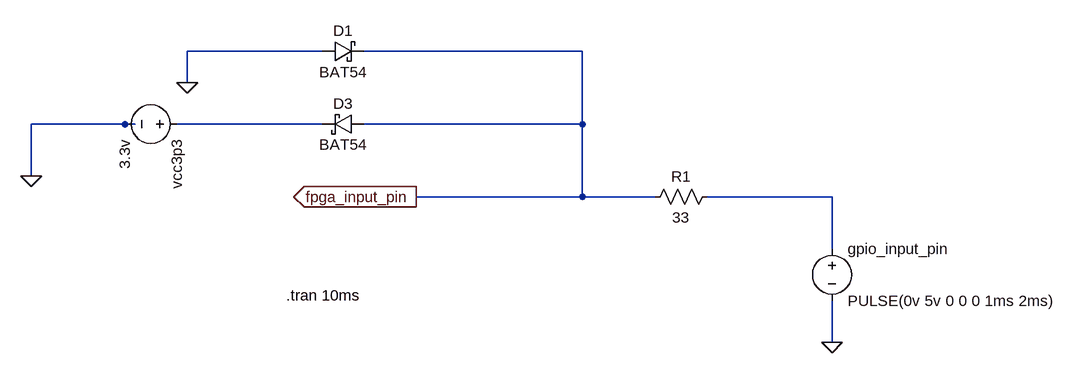
[diagram p0: schematic de0-cv-gpio-test2.asc]
de0-cv-gpio-test2.asc, the LTspice schematic file:
Version 4
SHEET 1 984 680
WIRE -192 -48 -400 -48
WIRE 208 -48 -128 -48
WIRE -400 0 -400 -48
WIRE -496 64 -640 64
WIRE -480 64 -496 64
WIRE -192 64 -416 64
WIRE 208 64 208 -48
WIRE 208 64 -128 64
WIRE -640 144 -640 64
WIRE 208 176 208 64
WIRE 208 176 -48 176
WIRE 320 176 208 176
WIRE 592 176 400 176
WIRE 592 256 592 176
WIRE 592 400 592 336
FLAG -400 0 0
FLAG -48 176 fpga_input_pin
IOPIN -48 176 Out
FLAG 592 400 0
FLAG -640 144 0
SYMBOL voltage 592 240 R0
WINDOW 123 0 0 Left 2
WINDOW 39 0 0 Left 2
SYMATTR InstName gpio_input_pin
SYMATTR Value PULSE(0v 5v 0 0 0 1ms 2ms)
SYMBOL voltage -400 64 R90
WINDOW 123 0 0 Left 2
WINDOW 39 0 0 Left 2
SYMATTR InstName vcc3p3
SYMATTR Value 3.3v
SYMBOL res 416 160 R90
WINDOW 0 0 56 VBottom 2
WINDOW 3 32 56 VTop 2
SYMATTR InstName R1
SYMATTR Value 33
SYMBOL schottky -128 48 R90
WINDOW 0 0 32 VBottom 2
WINDOW 3 32 32 VTop 2
SYMATTR InstName D3
SYMATTR Value BAT54
SYMATTR Description Diode
SYMATTR Type diode
SYMBOL schottky -192 -32 R270
WINDOW 0 32 32 VTop 2
WINDOW 3 0 32 VBottom 2
SYMATTR InstName D1
SYMATTR Value BAT54
SYMATTR Description Diode
SYMATTR Type diode
TEXT -248 328 Left 2 !.tran 10ms

The netlist it stands for:
* de0-cv-gpio-test2.asc
V§gpio_input_pin N002 0 PULSE(0v 5v 0 0 0 1ms 2ms)
vcc3p3 N001 0 3.3v
R1 N002 fpga_input_pin 33
D3 fpga_input_pin N001 BAT54
D1 0 fpga_input_pin BAT54
.model D D
.lib standard.dio
.tran 10ms
.backanno
.end